# Altium schematic sheet 2P terminal.schdoc
size 44 x 37 mm
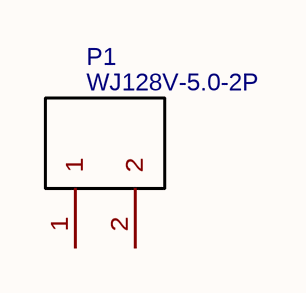
[diagram p0: 2P terminal.schdoc]

## Parts
P1  WJ128V-5.0-2P  [CONN-TH_2P-P5.00_WJ128V-5.0-2P]

## Nets

Not connected (* = marked no-connect by the designer): P1 1 2

## Library data of the parts
P1 = WJ128V-5.0-2P: Manufacturer: KANGNEX(康奈克斯电气); Supplier: LCSC; Manufacturer Part: WJ128V-5.0-2P; Supplier Part: C8269; JLCPCB Part Class: Extended Part; spicePre: P; spiceSymbolName: WJ128V-5.0-2P